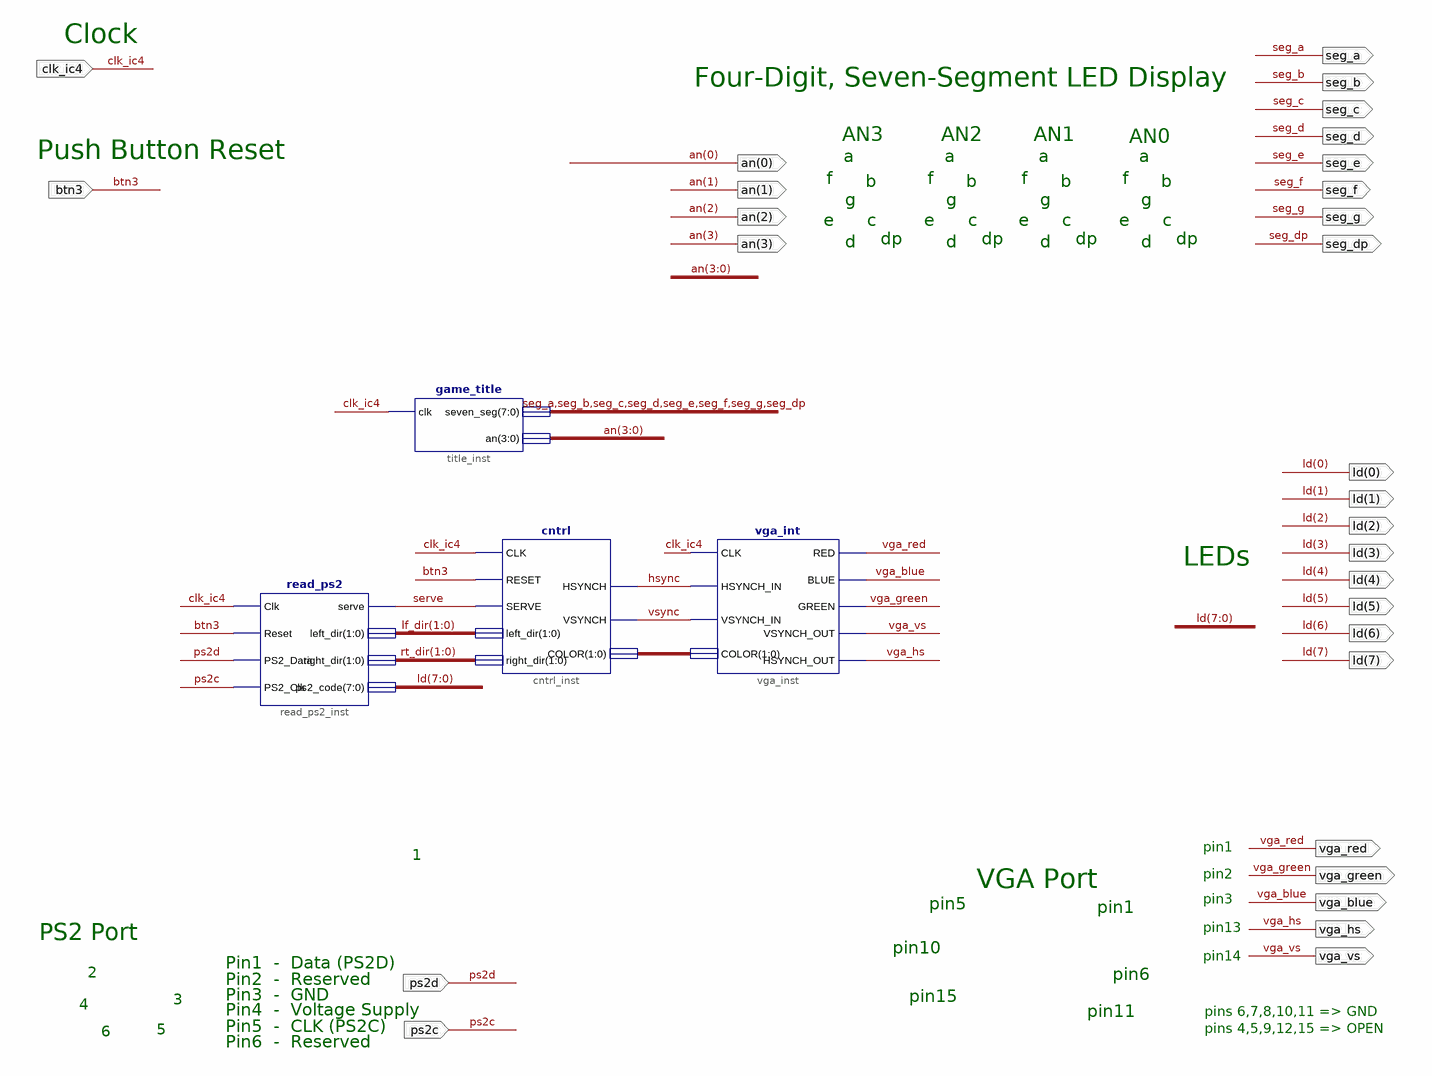
[diagram p0: schematic sheet 1]
// Xilinx ISE schematic pong_top.sch (spartan3) as structural Verilog: 4 symbols, 29 ports
module pong_top (
  input  ps2c,
  input  clk_ic4,
  input  ps2d,
  input  btn3,
  output seg_a,
  output seg_b,
  output seg_c,
  output seg_d,
  output seg_e,
  output seg_f,
  output seg_g,
  output seg_dp,
  output [3:0] an,
  output vga_red,
  output vga_green,
  output vga_blue,
  output vga_hs,
  output vga_vs,
  output [7:0] ld
);

  wire hsync, serve, vsync;
  wire [1:0] lf_dir, rt_dir, XLXN_31;

  read_ps2 read_ps2_inst (
    .Clk(clk_ic4), .PS2_Clk(ps2c), .PS2_Data(ps2d), .Reset(btn3), .left_dir(lf_dir), .right_dir(rt_dir),
    .serve(serve), .ps2_code(ld));
  cntrl cntrl_inst (
    .CLK(clk_ic4), .RESET(btn3), .SERVE(serve), .HSYNCH(hsync), .VSYNCH(vsync), .COLOR(XLXN_31),
    .left_dir(lf_dir), .right_dir(rt_dir));
  vga_int vga_inst (
    .CLK(clk_ic4), .COLOR(XLXN_31), .RED(vga_red), .BLUE(vga_blue), .GREEN(vga_green), .VSYNCH_OUT(vga_vs),
    .HSYNCH_OUT(vga_hs), .HSYNCH_IN(hsync), .VSYNCH_IN(vsync));
  game_title title_inst (.clk(clk_ic4), .seven_seg({seg_a, seg_b, seg_c, seg_d, seg_e, seg_f, seg_g, seg_dp}), .an(an));

  // Notes on the sheet:
  //   Clock
  //   Four-Digit, Seven-Segment LED Display
  //   AN3
  //   AN2
  //   AN1
  //   AN0
  //   Push Button Reset
  //   a
  //   a
  //   a
  //   a
  //   f
  //   f
  //   f
  //   f
  //   b
  //   b
  //   b
  //   b
  //   g
  //   g
  //   g
  //   g
  //   e
  //   c
  //   e
  //   c
  //   e
  //   c
  //   e
  //   c
  //   dp
  //   dp
  //   dp
  //   dp
  //   d
  //   d
  //   d
  //   d
  //   LEDs
  //   pin1
  //   1
  //   pin2
  //   VGA Port
  //   pin3
  //   pin5
  //   pin1
  //   pin13
  //   PS2 Port
  //   pin10
  //   pin14
  //   Pin1  -  Data (PS2D)
  //   2
  //   pin6
  //   Pin2  -  Reserved
  //   Pin3  -  GND
  //   pin15
  //   3
  //   4
  //   Pin4  -  Voltage Supply
  //   pin11
  //   pins 6,7,8,10,11 => GND
  //   Pin5  -  CLK (PS2C)
  //   pins 4,5,9,12,15 => OPEN
  //   5
  //   6
  //   Pin6  -  Reserved
  //   LOC on signal seg_a = e14
  //   LOC on signal seg_b = g13
  //   LOC on signal seg_c = n15
  //   LOC on signal seg_d = p15
  //   LOC on signal seg_e = r16
  //   LOC on signal seg_f = f13
  //   LOC on signal seg_g = n16
  //   LOC on signal seg_dp = p16
  //   LOC on signal an(0) = d14
  //   LOC on signal an(1) = g14
  //   LOC on signal an(2) = f14
  //   LOC on signal an(3) = e13
  //   LOC on signal vga_red = r12
  //   LOC on signal vga_green = t12
  //   LOC on signal vga_blue = r11
  //   LOC on signal vga_hs = r9
  //   LOC on signal vga_vs = t10
  //   LOC on signal ps2c = m16
  //   LOC on signal clk_ic4 = t9
  //   LOC on signal ps2d = m15
  //   LOC on signal btn3 = l14
  //   LOC on signal ld(0) = k12
  //   LOC on signal ld(1) = p14
  //   LOC on signal ld(2) = l12
  //   LOC on signal ld(4) = p13
  //   LOC on signal ld(5) = n12
  //   LOC on signal ld(6) = p12
  //   LOC on signal ld(7) = p11
  //   LOC on signal ld(3) = n14
endmodule
